# Altium schematic sheet Sheet3.SchDoc: solar-powered-remote-water-level-relay
size 419 x 297 mm; Date: 2026/06/29; Author: forlook88@gmail.com; Revision: 0; SheetNumber: 3; SheetTotal: 11
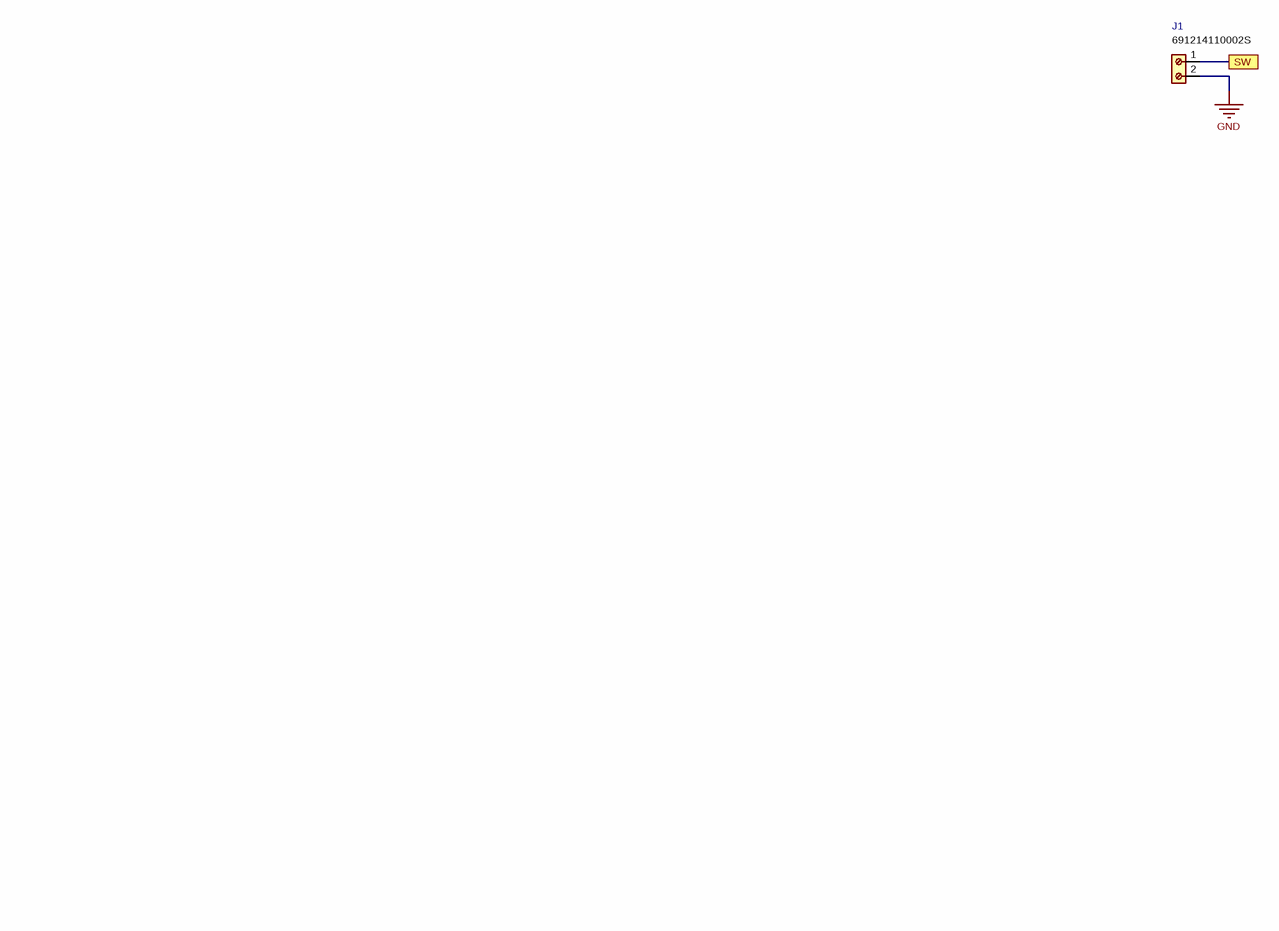
[diagram p0: Sheet3.SchDoc]

## Parts
J1  value 691214110002S

## Ports
SW

## Nets
GND: J1.2
SW: J1.1 ; port SW

## Notes on the sheet
- Document Name:
- Project Name:
- Sheet Name:
- Sheet Number:
- Author:
- CELUS Design Platform electronic designs are machine-generated drafts and require verification by qualified specialists.
- of
- Revision:
- Date:
- By using these designs, you agree to the CELUS Terms of Use: https://www.celus.io/terms-of-use

## Library data of the parts
J1 = (no symbol name): Manufacturer: Würth Elektronik; Manufacturer Part Number: 691214110002S